# Altium schematic sheet BLUE_TO_IDC_Sheet1.SchDoc
size A3; SheetNumber: 1; SheetTotal: 1
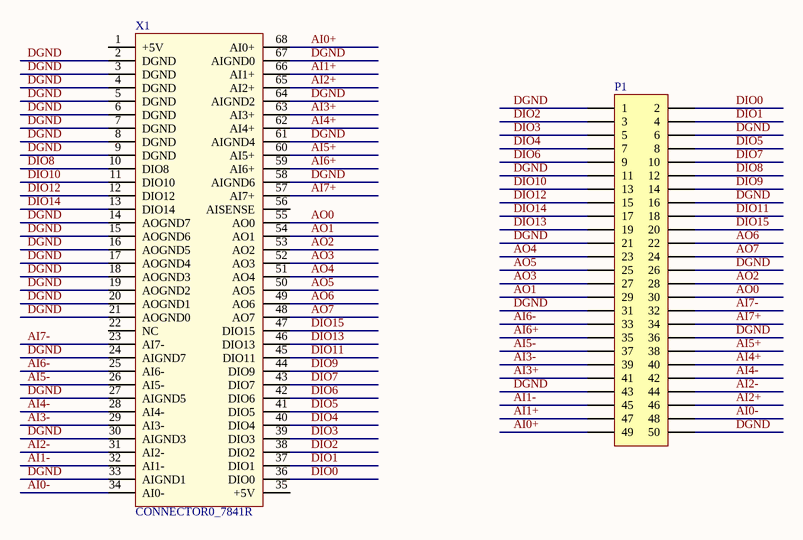
[diagram p0: BLUE_TO_IDC_Sheet1.SchDoc]

## Parts
P1  Header 25X2  [HDR2X25]  (value not drawn)
X1  CONNECTOR0_7841R  [CONNECTOR0_7841R]

## Nets
AI0+: P1.49 X1.68(AI0+)
AI0-: P1.48 X1.34(AI0-)
AI1+: P1.47 X1.66(AI1+)
AI1-: P1.45 X1.32(AI1-)
AI2+: P1.46 X1.65(AI2+)
AI2-: P1.44 X1.31(AI2-)
AI3+: P1.41 X1.63(AI3+)
AI3-: P1.39 X1.29(AI3-)
AI4+: P1.40 X1.62(AI4+)
AI4-: P1.42 X1.28(AI4-)
AI5+: P1.38 X1.60(AI5+)
AI5-: P1.37 X1.26(AI5-)
AI6+: P1.35 X1.59(AI6+)
AI6-: P1.33 X1.25(AI6-)
AI7+: P1.34 X1.57(AI7+)
AI7-: P1.32 X1.23(AI7-)
AO0: P1.30 X1.55(AO0)
AO1: P1.29 X1.54(AO1)
AO2: P1.28 X1.53(AO2)
AO3: P1.27 X1.52(AO3)
AO4: P1.23 X1.51(AO4)
AO5: P1.25 X1.50(AO5)
AO6: P1.22 X1.49(AO6)
AO7: P1.24 X1.48(AO7)
DGND: P1.1 P1.6 P1.11 P1.16 P1.21 P1.26 P1.31 P1.36 P1.43 P1.50 X1.2(DGND) X1.3(DGND) X1.4(DGND) X1.5(DGND) X1.6(DGND) X1.7(DGND) X1.8(DGND) X1.9(DGND) X1.14(AOGND7) X1.15(AOGND6) X1.16(AOGND5) X1.17(AOGND4) X1.18(AOGND3) X1.19(AOGND2) X1.20(AOGND1) X1.21(AOGND0) X1.24(AIGND7) X1.27(AIGND5) X1.30(AIGND3) X1.33(AIGND1) X1.58(AIGND6) X1.61(AIGND4) X1.64(AIGND2) X1.67(AIGND0)
DIO0: P1.2 X1.36(DIO0)
DIO1: P1.4 X1.37(DIO1)
DIO2: P1.3 X1.38(DIO2)
DIO3: P1.5 X1.39(DIO3)
DIO4: P1.7 X1.40(DIO4)
DIO5: P1.8 X1.41(DIO5)
DIO6: P1.9 X1.42(DIO6)
DIO7: P1.10 X1.43(DIO7)
DIO8: P1.12 X1.10(DIO8)
DIO9: P1.14 X1.44(DIO9)
DIO10: P1.13 X1.11(DIO10)
DIO11: P1.18 X1.45(DIO11)
DIO12: P1.15 X1.12(DIO12)
DIO13: P1.19 X1.46(DIO13)
DIO14: P1.17 X1.13(DIO14)
DIO15: P1.20 X1.47(DIO15)

Not connected (* = marked no-connect by the designer): X1 1(+5V) 22(NC) 35(+5V) 56(AISENSE)

## Library data of the parts
P1 = Header 25X2: Header, 25-Pin, Dual row; LatestRevisionDate: 17-Jul-2002; LatestRevisionNote: Re-released for DXP Platform.; Publisher: Altium Limited